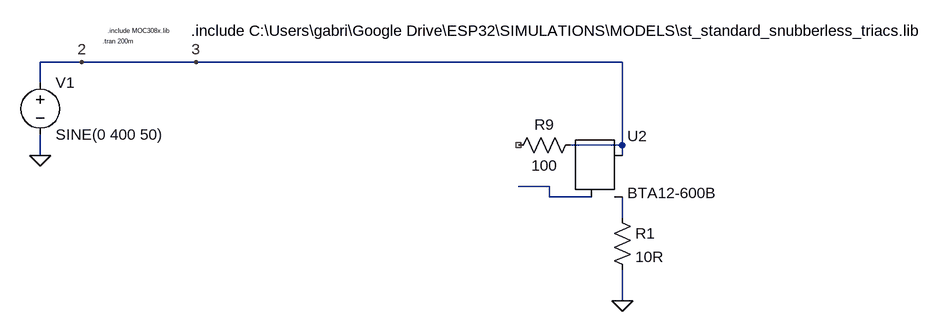
[diagram p0: schematic moc_308x_test.asc]
moc_308x_test.asc, the LTspice schematic file:
Version 4
SHEET 1 1284 692
WIRE -752 -192 -816 -192
WIRE -576 -192 -752 -192
WIRE 80 -192 -576 -192
WIRE -816 -160 -816 -192
WIRE 80 -64 80 -192
WIRE 80 -64 0 -64
WIRE -816 -48 -816 -80
WIRE 80 -48 80 -64
WIRE -32 0 -80 0
WIRE -32 16 -32 0
WIRE 32 16 -32 16
WIRE 80 48 80 16
WIRE 80 176 80 128
FLAG -816 -48 0
FLAG -576 -192 3
FLAG 80 176 0
FLAG -752 -192 2
SYMBOL voltage -816 -176 R0
WINDOW 123 0 0 Left 0
WINDOW 39 0 0 Left 0
SYMATTR InstName V1
SYMATTR Value SINE(0 400 50)
SYMBOL res -96 -48 R270
WINDOW 0 32 56 VTop 2
WINDOW 3 0 56 VBottom 2
SYMATTR InstName R9
SYMATTR Value 100
SYMBOL res 64 32 R0
SYMATTR InstName R1
SYMATTR Value 10R
SYMBOL Misc\\TRIAC 48 -48 R0
SYMATTR InstName U2
SYMATTR Value BTA12-600B
TEXT -720 -224 Left 0 !.tran 200m
TEXT -712 -240 Left 0 !.include MOC308x.lib
TEXT -584 -240 Left 2 !.include C:\\Users\\gabri\\Google Drive\\ESP32\\SIMULATIONS\\MODELS\\st_standard_snubberless_triacs.lib

The netlist it stands for:
* moc_308x_test.asc
V1 2 0 SINE(0 400 50)
R9 NC_01 2 100
R1 N002 0 10R
XU2 2 N001 N002 BTA12-600B  ; pins MT2 G MT1
.tran 200m
.include MOC308x.lib
.include C:\Users\gabri\Google Drive\ESP32\SIMULATIONS\MODELS\st_standard_snubberless_triacs.lib
.backanno
.end